# Altium schematic sheet Motor_4.SchDoc
size A4
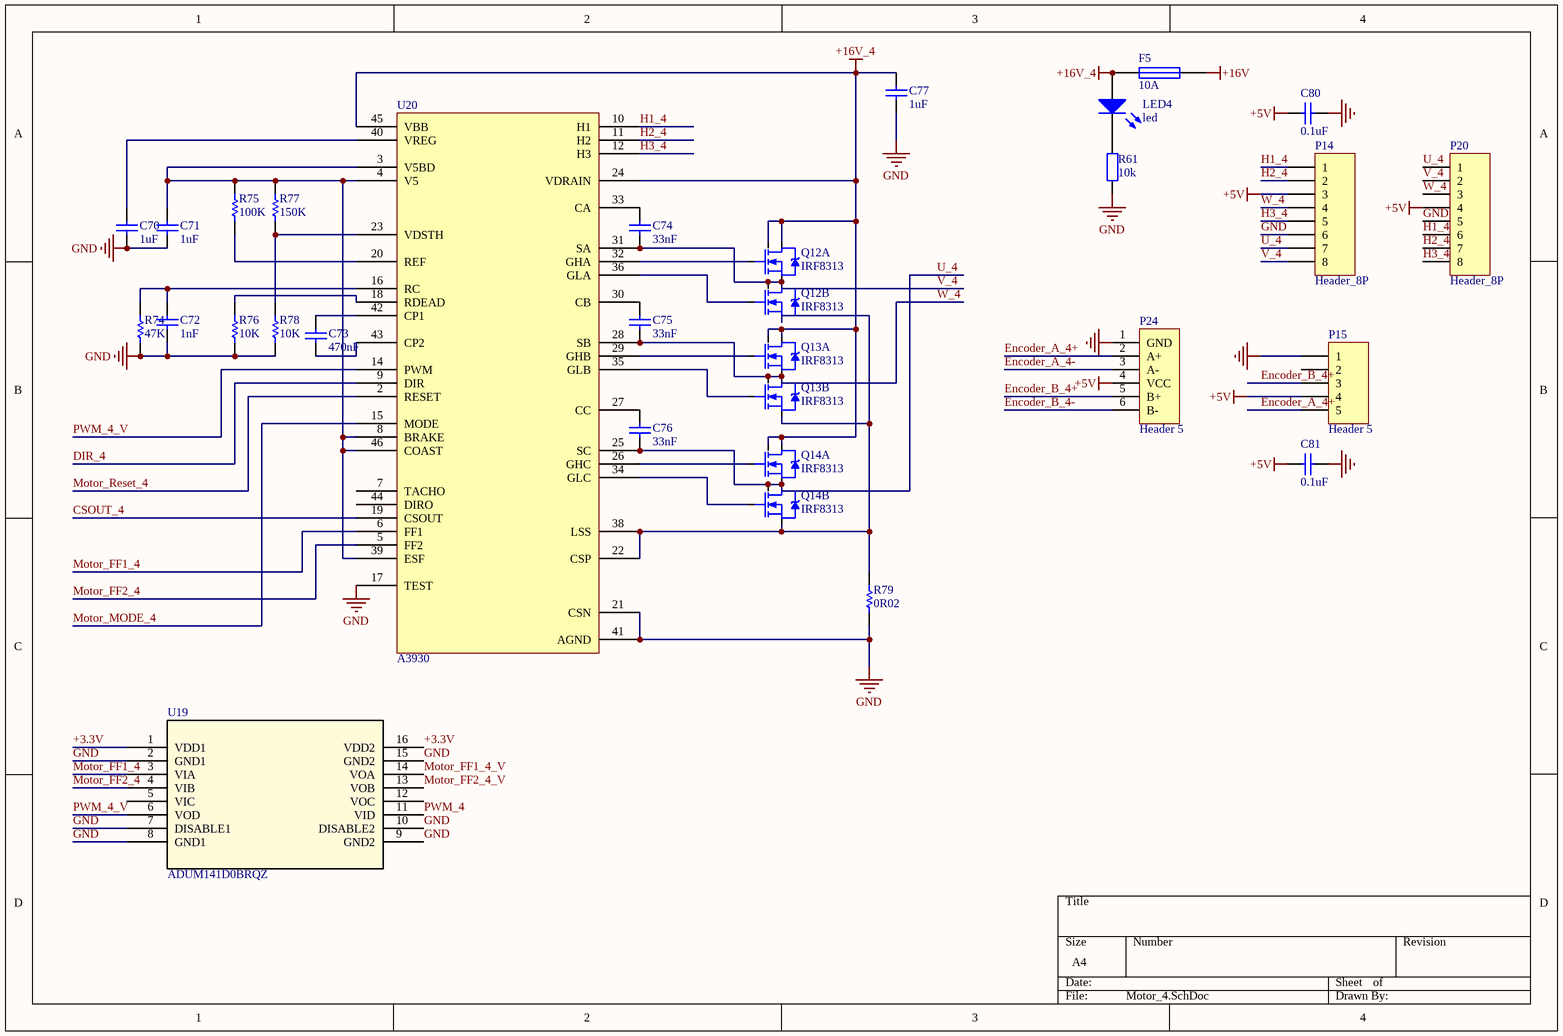
[diagram p0: Motor_4.SchDoc]

## Parts
C70  1uf  [0603C]
C71  1uf  [0603C]
C72  1nf  [0603C]
C73  470nf  [0603C]
C74  33nf  [0603C]
C75  33nf  [0603C]
C76  33nf  [0603C]
C77  1uf  [0603C]
C80  0.1uf  [0603C]
C81  0.1uf  [0603C]
F5  10A  [FUSE_HEADER]
LED4  led  [0603_diode]
P14  Header_8P  [8P - WF25122]
P15  Header 5  [SHDR5]
P20  Header_8P  [SHDR8]
P24  Header 5  [SHDR6]
Q12  IRF8313  [so-8 bg]  (parts A,B of 2)
Q13  IRF8313  [so-8 bg]  (parts A,B of 2)
Q14  IRF8313  [so-8 bg]  (parts A,B of 2)
R61  10k  [0603]
R74  47k  [0603R]
R75  100k  [0603R]
R76  10k  [0603R]
R77  150k  [0603R]
R78  10k  [0603R]
R79  value 0R02  [1206 10A]  (hidden comment: 0.02)
U19  ADUM141D0BRQZ  [RQ_16]
U20  A3930  [LQFP-48]

## Nets
+5V: C80.2 C81.2 P14.3 P15.4 P20.4 P24.4(VCC)
+16V: F5.1
+16V_4: C77.2 F5.2 LED4.1(A) Q12.7(D2) Q12.8(D2) Q13.7(D2) Q13.8(D2) Q14.7(D2) Q14.8(D2) U20.24(VDRAIN) U20.45(VBB)
GND: C70.1 C71.1 C72.1 C77.1 C80.1 C81.1 P14.6 P15.1 P20.5 P24.1(GND) R61.1 R74.1 R76.1 R78.1 R79.1 U19.2(GND1) U19.7(DISABLE1) U19.8(GND1) U19.9(GND2) U19.10(DISABLE2) U19.15(GND2) U20.17(TEST) U20.21(CSN) U20.41(AGND)
+3.3V: U19.1(VDD1) U19.16(VDD2)
CSOUT_4: U20.19(CSOUT)
DIR_4: U20.9(DIR)
Encoder_A_4+: P15.5 P24.2(A+)
Encoder_A_4-: P24.3(A-)
Encoder_B_4+: P15.3 P24.5(B+)
Encoder_B_4-: P24.6(B-)
H1_4: P14.1 P20.6 U20.10(H1)
H2_4: P14.2 P20.7 U20.11(H2)
H3_4: P14.5 P20.8 U20.12(H3)
Motor_FF1_4: U19.3(VIA) U20.6(FF1)
Motor_FF1_4_V: U19.14(VOA)
Motor_FF2_4: U19.4(VIB) U20.5(FF2)
Motor_FF2_4_V: U19.13(VOB)
Motor_MODE_4: U20.15(MODE)
Motor_Reset_4: U20.2(RESET)
PWM_4: U19.11(VID)
PWM_4_V: U19.6(VOD) U20.14(PWM)
U_4: C76.1 P14.7 P20.1 Q14.1(S2) Q14.5(D1) Q14.6(D1) U20.25(SC)
V_4: C74.1 P14.8 P20.2 Q12.1(S2) Q12.5(D1) Q12.6(D1) U20.31(SA)
W_4: C75.1 P14.4 P20.3 Q13.1(S2) Q13.5(D1) Q13.6(D1) U20.28(SB)
NetC70_2: C70.2 U20.40(VREG)
NetC71_2: C71.2 R75.2 R77.2 U20.3(V5BD) U20.4(V5) U20.8(BRAKE) U20.39(ESF) U20.46(COAST)
NetC72_2: C72.2 R74.2 U20.16(RC)
NetC73_1: C73.1 U20.43(CP2)
NetC73_2: C73.2 U20.42(CP1)
NetC74_2: C74.2 U20.33(CA)
NetC75_2: C75.2 U20.30(CB)
NetC76_2: C76.2 U20.27(CC)
NetLED4_2: LED4.2(K) R61.2
NetQ12_2: Q12.2(G2) U20.32(GHA)
NetQ12_3: Q12.3(S1) Q13.3(S1) Q14.3(S1) R79.2 U20.22(CSP) U20.38(LSS)
NetQ12_4: Q12.4(G1) U20.36(GLA)
NetQ13_2: Q13.2(G2) U20.29(GHB)
NetQ13_4: Q13.4(G1) U20.35(GLB)
NetQ14_2: Q14.2(G2) U20.26(GHC)
NetQ14_4: Q14.4(G1) U20.34(GLC)
NetR75_1: R75.1 U20.20(REF)
NetR76_2: R76.2 U20.18(RDEAD)
NetR77_1: R77.1 R78.2 U20.23(VDSTH)

Not connected (* = marked no-connect by the designer): P15 2; U19 5(VIC) 12(VOC); U20 7(TACHO) 44(DIRO)

## Library data of the parts
C70-C77 C80 C81 = Cap: Capacitor; Manufacturer: Generic Components; Class: Passive; Published: 08/06/2000; Publisher: Altium Hobart Technology Centre; SubClass: Capacitor
  C70 C71 C77: Value: 1uF
  C72: Value: 1nF
  C73: Value: 470nF
  C74-C76: Value: 33nF
  C80 C81: Value: 0.1uF
F5 = FUSE
P14 P20 = Header_8P: Used for Motor connection in ZJUNlict
P15 = Header 5: Header, 5-Pin; LatestRevisionDate: 17-Jul-2002; LatestRevisionNote: Re-released for DXP Platform.; Publisher: Altium Limited
P24 = Header 6: Header, 5-Pin; LatestRevisionDate: 17-Jul-2002; LatestRevisionNote: Re-released for DXP Platform.; Publisher: Altium Limited
Q12-Q14 = SO-8 IRF8313
R61 = res
R74-R79 = Res1: Resistor; Manufacturer: Generic Components; Class: Passive; Published: 08/06/2000; Publisher: Altium Hobart Technology Centre; SubClass: Resistor
  R74: Value: 47K
  R75: Value: 100K
  R76 R78: Value: 10K
  R77: Value: 150K
U19 = ADUM141D0BRQZ: Imported; RefDes: RefDes; Type: DEV; Value: Value
U20 = LQFP 48